# Altium project DOAN.PrjPcb
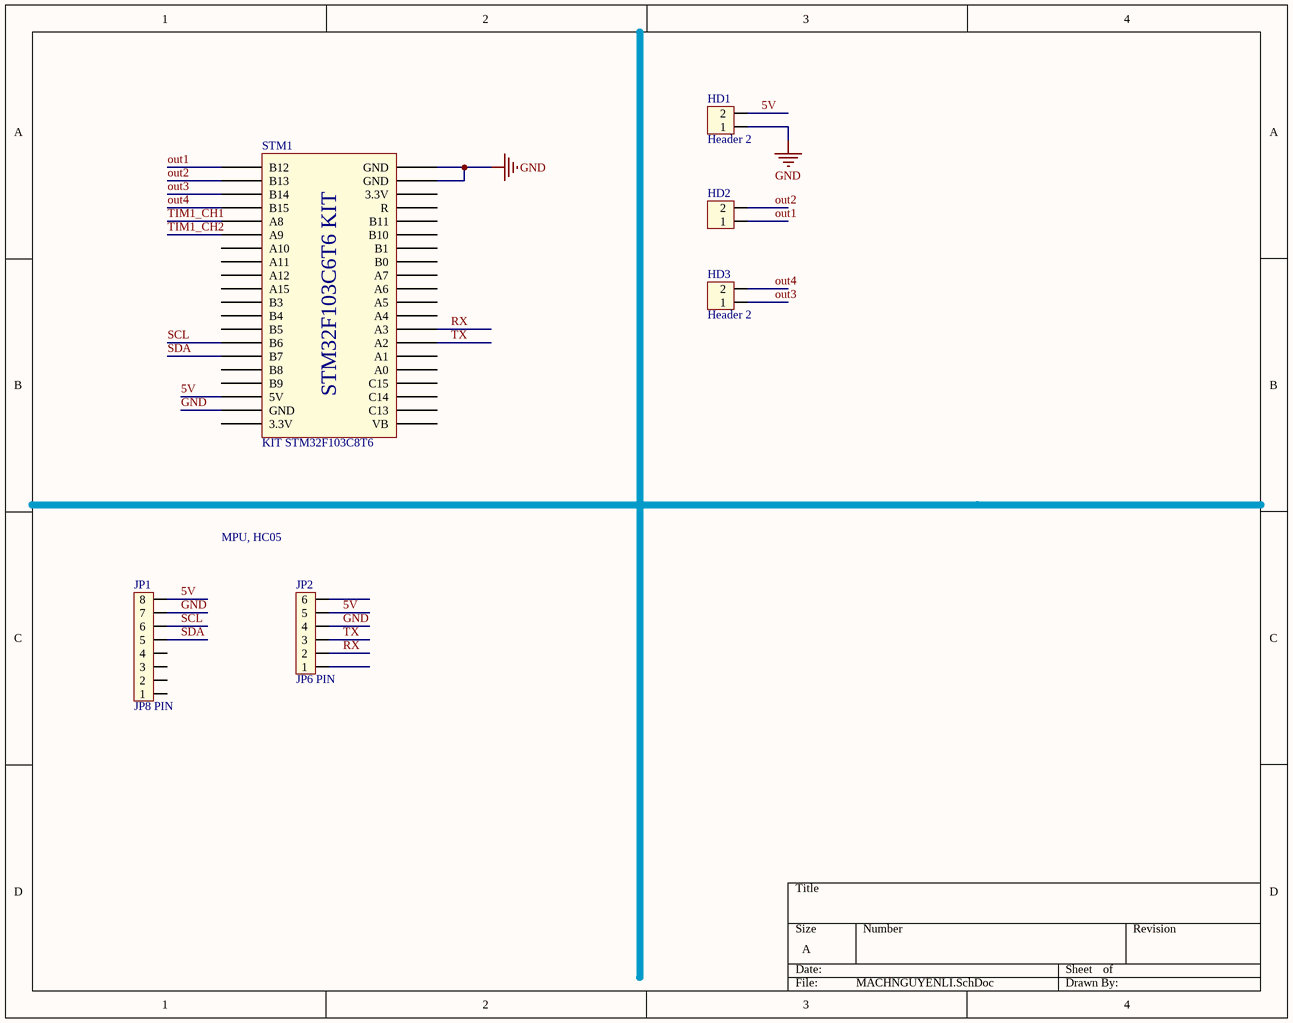
[diagram p0: MACHNGUYENLI.SchDoc]
1 sheet, 6 parts. Net scope: global (net labels, ports and power ports of the same name join across sheets).
Board file: MACHIN2.PcbDoc

## Sheet MACHNGUYENLI.SchDoc
size A

### Parts
HD1  Header 2  [HED2T]
HD2  (no value)  [HED2]
HD3  Header 2  [HED2]
JP1  JP8 PIN  [JP8]
JP2  JP6 PIN  [JP6]
STM1  KIT STM32F103C8T6  [STM32F103 KIT]

### Nets
GND: HD1.1 JP1.7 JP2.4 STM1.19(GND) STM1.39(GND) STM1.40(GND)
5V: HD1.2 JP1.8 JP2.5 STM1.18(5V)
out1: HD2.1 STM1.1(B12)
out2: HD2.2 STM1.2(B13)
out3: HD3.1 STM1.3(B14)
out4: HD3.2 STM1.4(B15)
RX: JP2.2 STM1.28(A3)
SCL: JP1.6 STM1.14(B6)
SDA: JP1.5 STM1.15(B7)
TIM1_CH1: STM1.5(A8)
TIM1_CH2: STM1.6(A9)
TX: JP2.3 STM1.27(A2)

Not connected (* = marked no-connect by the designer): JP1 1 2 3 4; JP2 1 6; STM1 7(A10) 8(A11) 9(A12) 10(A15) 11(B3) 12(B4) 13(B5) 16(B8) 17(B9) 20(3.3V) 21(VB) 22(C13) 23(C14) 24(C15) 25(A0) 26(A1) 29(A4) 30(A5) 31(A6) 32(A7) 33(B0) 34(B1) 35(B10) 36(B11) 37(R) 38(3.3V)

### Notes on the sheet
- MPU, HC05
- (in symbol STM32f103 Bluepill) STM32F103C6T6 KIT

### Library data of the parts
HD1-HD3 = Hed2: Header 2 (Green); Value: Header 2
JP1 = JP8: Value: JP7
JP2 = JP6: Value: JP7
STM1 = STM32f103 Bluepill: KIT STM32F103C8T6 Bluepill